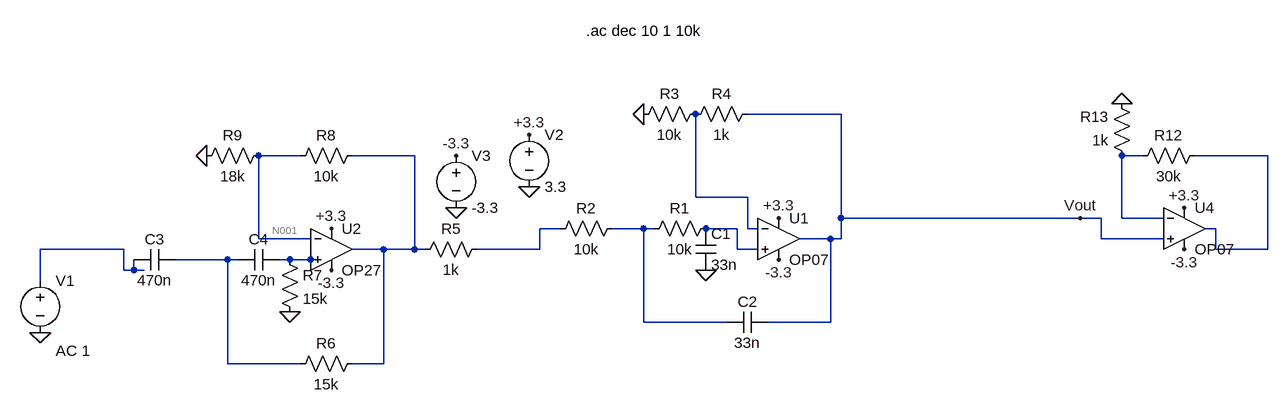
[diagram p0: schematic EMG_BANDPASS_filter_test.asc]
EMG_BANDPASS_filter_test.asc, the LTspice schematic file:
Version 4.1
SHEET 1 948 680
WIRE 288 -32 144 -32
WIRE -544 32 -608 32
WIRE -368 32 -464 32
WIRE 752 32 720 32
WIRE 944 32 832 32
WIRE 64 96 64 -32
WIRE 144 96 64 96
WIRE 288 128 288 -32
WIRE 656 128 288 128
WIRE 688 128 656 128
WIRE 720 128 720 32
WIRE 784 128 720 128
WIRE -144 144 -176 144
WIRE -16 144 -64 144
WIRE 0 144 -16 144
WIRE 128 144 80 144
WIRE 144 144 144 96
WIRE 160 144 144 144
WIRE 864 144 848 144
WIRE -608 160 -608 32
WIRE -528 160 -608 160
WIRE 272 160 224 160
WIRE 288 160 288 128
WIRE 288 160 272 160
WIRE 688 160 688 128
WIRE 784 160 688 160
WIRE -816 176 -944 176
WIRE -416 176 -464 176
WIRE -368 176 -368 32
WIRE -368 176 -416 176
WIRE -352 176 -368 176
WIRE -176 176 -176 144
WIRE -176 176 -272 176
WIRE 128 176 128 144
WIRE 160 176 128 176
WIRE 864 176 864 144
WIRE 944 176 944 32
WIRE 944 176 864 176
WIRE -656 192 -736 192
WIRE -640 192 -656 192
WIRE -560 192 -576 192
WIRE -528 192 -560 192
WIRE -512 192 -528 192
WIRE -816 208 -816 176
WIRE -800 208 -800 192
WIRE -800 208 -816 208
WIRE -784 208 -800 208
WIRE -944 224 -944 176
WIRE -16 288 -16 144
WIRE 112 288 -16 288
WIRE 272 288 272 160
WIRE 272 288 176 288
WIRE -656 352 -656 192
WIRE -544 352 -656 352
WIRE -416 352 -416 176
WIRE -416 352 -464 352
FLAG 80 208 0
FLAG -304 112 0
FLAG -192 80 0
FLAG -192 0 +3.3
FLAG -304 32 -3.3
FLAG 192 128 +3.3
FLAG 192 192 -3.3
FLAG -16 -32 0
FLAG -496 144 +3.3
FLAG -496 208 -3.3
FLAG -560 272 0
FLAG -944 304 0
FLAG -688 32 0
FLAG 656 128 Vout
FLAG 816 112 +3.3
FLAG 816 176 -3.3
FLAG 720 -48 0
SYMBOL OpAmps\\OP07 192 96 R0
SYMATTR InstName U1
SYMBOL res 96 128 R90
WINDOW 0 0 56 VBottom 2
WINDOW 3 32 56 VTop 2
SYMATTR InstName R1
SYMATTR Value 10k
SYMBOL cap 64 144 R0
SYMATTR InstName C1
SYMATTR Value 33n
SYMBOL voltage -192 -16 R0
WINDOW 123 0 0 Left 0
WINDOW 39 0 0 Left 0
SYMATTR InstName V2
SYMATTR Value 3.3
SYMBOL voltage -304 16 R0
WINDOW 123 0 0 Left 0
WINDOW 39 0 0 Left 0
SYMATTR InstName V3
SYMATTR Value -3.3
SYMBOL cap 176 272 R90
WINDOW 0 0 32 VBottom 2
WINDOW 3 32 32 VTop 2
SYMATTR InstName C2
SYMATTR Value 33n
SYMBOL res -48 128 R90
WINDOW 0 0 56 VBottom 2
WINDOW 3 32 56 VTop 2
SYMATTR InstName R2
SYMATTR Value 10k
SYMBOL res 80 -48 R90
WINDOW 0 0 56 VBottom 2
WINDOW 3 32 56 VTop 2
SYMATTR InstName R3
SYMATTR Value 10k
SYMBOL res 160 -48 R90
WINDOW 0 0 56 VBottom 2
WINDOW 3 32 56 VTop 2
SYMATTR InstName R4
SYMATTR Value 1k
SYMBOL res -256 160 R90
WINDOW 0 0 56 VBottom 2
WINDOW 3 32 56 VTop 2
SYMATTR InstName R5
SYMATTR Value 1k
SYMBOL OpAmps\\OP27 -496 112 R0
SYMATTR InstName U2
SYMBOL res -448 336 R90
WINDOW 0 0 56 VBottom 2
WINDOW 3 32 56 VTop 2
SYMATTR InstName R6
SYMATTR Value 15k
SYMBOL cap -736 176 R90
WINDOW 0 0 32 VBottom 2
WINDOW 3 32 32 VTop 2
SYMATTR InstName C3
SYMATTR Value 470n
SYMBOL cap -576 176 R90
WINDOW 0 0 32 VBottom 2
WINDOW 3 32 32 VTop 2
SYMATTR InstName C4
SYMATTR Value 470n
SYMBOL res -576 176 R0
SYMATTR InstName R7
SYMATTR Value 15k
SYMBOL voltage -944 208 R0
WINDOW 123 24 124 Left 2
WINDOW 39 0 0 Left 0
SYMATTR Value2 AC 1
SYMATTR InstName V1
SYMATTR Value ""
SYMBOL res -448 16 R90
WINDOW 0 0 56 VBottom 2
WINDOW 3 32 56 VTop 2
SYMATTR InstName R8
SYMATTR Value 10k
SYMBOL res -592 16 R90
WINDOW 0 0 56 VBottom 2
WINDOW 3 32 56 VTop 2
SYMATTR InstName R9
SYMATTR Value 18k
SYMBOL OpAmps\\OP07 816 80 R0
SYMATTR InstName U4
SYMBOL res 848 16 R90
WINDOW 0 0 56 VBottom 2
WINDOW 3 32 56 VTop 2
SYMATTR InstName R12
SYMATTR Value 30k
SYMBOL res 736 48 R180
WINDOW 0 36 76 Left 2
WINDOW 3 36 40 Left 2
SYMATTR InstName R13
SYMATTR Value 1k
TEXT -104 -160 Left 2 !.ac dec 10 1 10k

The netlist it stands for:
* EMG_BANDPASS_filter_test.asc
X§U1 N008 N005 +3.3 -3.3 Vout LT1001  ; OP07, pins In+ In- V+ V- OUT
R1 N008 N007 10k
C1 N008 0 33n
V2 +3.3 0 3.3
V3 -3.3 0 -3.3
C2 Vout N007 33n
R2 N007 N006 10k
R3 N005 0 10k
R4 Vout N005 1k
R5 N006 N002 1k
X§U2 N011 N001 +3.3 -3.3 N002 OP27  ; pins In+ In- V+ V- OUT
R6 N002 N010 15k
C3 N010 N009 470n
C4 N011 N010 470n
R7 N011 0 15k
V1 N009 0 AC 1
R8 N002 N001 10k
R9 N001 0 18k
X§U4 Vout N003 +3.3 -3.3 N004 LT1001  ; OP07, pins In+ In- V+ V- OUT
R12 N004 N003 30k
R13 N003 0 1k
.ac dec 10 1 10k
.lib LTC.lib
.lib ADI.lib
.backanno
.end

* Results of the author's LTspice run, read from the files saved beside the schematic
* Operating Point, zero values left out:
*   V(-3.3) = -3.3 V
*   V(+3.3) = 3.3 V
*   I(V3) = 6.882 mA
*   I(V2) = -6.882 mA
*   Ix(u2:3) = 2.382 mA
*   Ix(u2:4) = -2.382 mA
*   Ix(u1:3) = 2.25 mA
*   Ix(u1:4) = -2.25 mA
*   Ix(u4:3) = 2.25 mA
*   Ix(u4:4) = -2.25 mA
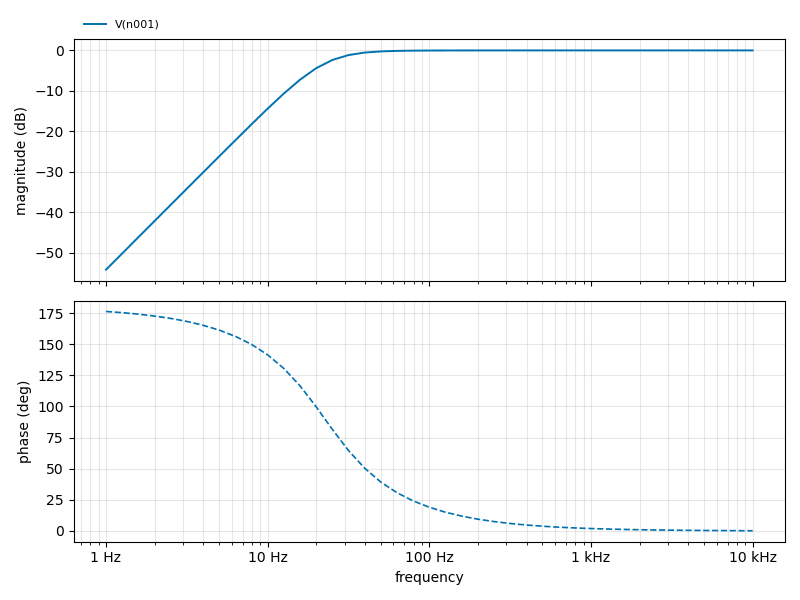
[diagram p1: AC Analysis of EMG_BANDPASS_filter_test.asc, plotted from the saved traces]
* AC Analysis, 1 run:
*   V(n001): -54.15 dB at 1 Hz, -0.00 dB at 10 kHz, peak -0.00 dB at 10 kHz, 3 dB below the peak at 23.34 Hz